# EAGLE board Detector (EAGLE 6.4)
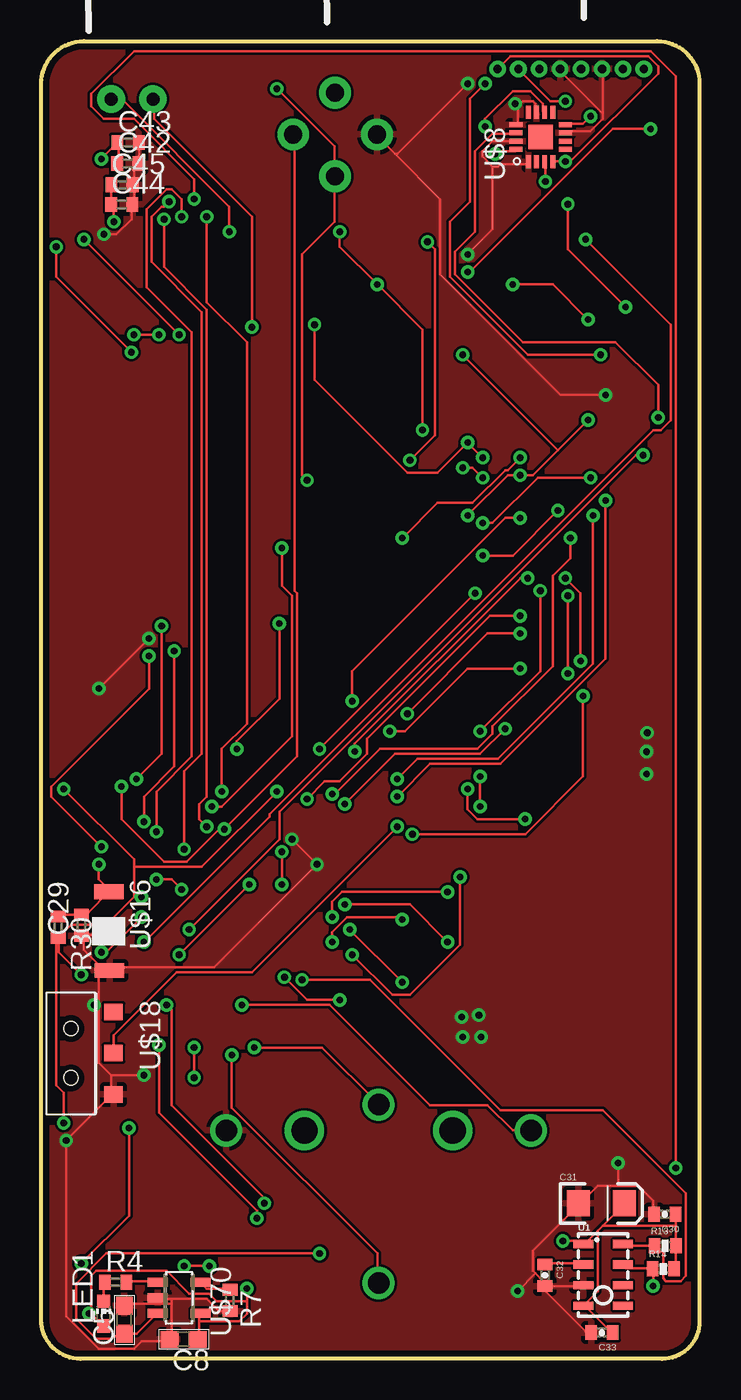
[diagram p7: board, top side]
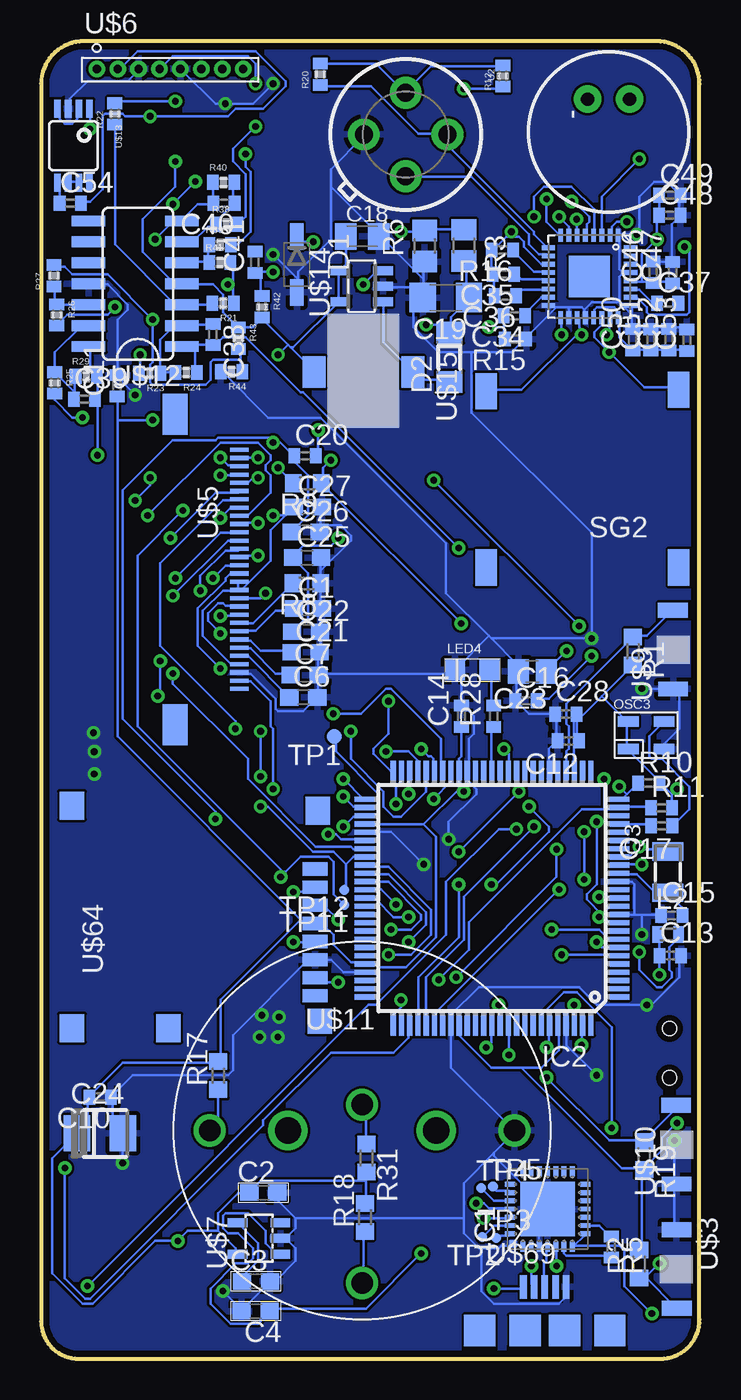
[diagram p8: board, bottom side, seen from below]

Size 40 x 80 mm. Coordinates in mm from the lower left corner, seen from the top.
Outline: 40,77.43 40,2.27 arc-90 37.73,0 2.38,0 arc-90 0,2.38 0,77.4 arc-90 2.6,80 37.43,80 arc-90 40,77.43
Copper layers (1*16): Top 0.035mm / dielectric 1.5mm / Bottom 0.035mm
Design rules "default *": minimum track width 6mil, minimum drill 16mil, track to track 6mil, track to pad 6mil, pad to pad 6mil, via to via 6mil, smd to smd 6mil, copper to edge 15mil, drill to drill 8mil, minimum pad ring 10mil, minimum via ring 8mil, stop-mask expansion 4mil, vias tented up to drill 0mil, thermal gap 10mil
Net classes: 3 battery: width 0.229 mm

## Footprints (pad centres in the part's own frame; a part is rotated, then mirrored left to right if it is on the bottom)
C0603 = smd 1.1 x 1: 1 -0.85,0; 2 0.85,0
C0402 = smd 0.7 x 0.9: 1 -0.65,0; 2 0.65,0
0402 = smd 0.7 x 0.9: 1 -0.65,0; 2 0.65,0
C0805K = smd 1.3 x 1.6: 1 -1,0; 2 1,0
C1206 = smd 1.6 x 1.8: 1 -1.4,0; 2 1.4,0
0805 = smd 1.3 x 1.5: 1 -0.85,0; 2 0.85,0
C106B = smd 1.6 x 2.2: 1 -1.4,0; 2 1.4,0
0402-CAP = smd 0.7 x 0.9: 1 -0.65,0; 2 0.65,0
EIA3216 = smd 1.4 x 1.6: A 1.4,0; C -1.4,0
SOD123 = smd 1.6 x 0.8: 1 -1.7,0; 2 1.7,0
SOD-123 = smd 1.3 x 1.6: 1 -1.5,0; 2 1.5,0
MLP28 = smd 0.6 x 0.3: 1 -2.3,1.5; 2 -2.3,1; 3 -2.3,0.5; 4 -2.3,0; 5 -2.3,-0.5; 6 -2.3,-1; 7 -2.3,-1.5; 15 2.3,-1.5; 16 2.3,-1; 17 2.3,-0.5; 18 2.3,0; 19 2.3,0.5; 20 2.3,1; 21 2.3,1.5 | smd 0.3 x 0.6: 8 -1.5,-2.3; 9 -1,-2.3; 10 -0.5,-2.3; 11 0,-2.3; 12 0.5,-2.3; 13 1,-2.3; 14 1.5,-2.3; 22 1.5,2.3; 23 1,2.3; 24 0.5,2.3; 25 0,2.3; 26 -0.5,2.3; 27 -1,2.3; 28 -1.5,2.3 | smd 3.3 x 3.3: EXP 0,0 | smd 0.435 x 0.435: M -2.103,2.103
LQFP100 = smd 1.2 x 0.32: 1 -7.75,6; 2 -7.75,5.5; 3 -7.75,5; 4 -7.75,4.5; 5 -7.75,4; 6 -7.75,3.5; 7 -7.75,3; 8 -7.75,2.5; 9 -7.75,2; 10 -7.75,1.5; 11 -7.75,1; 12 -7.75,0.5; 13 -7.75,0; 14 -7.75,-0.5; 15 -7.75,-1; 16 -7.75,-1.5; 17 -7.75,-2; 18 -7.75,-2.5; 19 -7.75,-3; 20 -7.75,-3.5; 21 -7.75,-4; 22 -7.75,-4.5; 23 -7.75,-5; 24 -7.75,-5.5; 25 -7.75,-6; 51 7.75,-6; 52 7.75,-5.5; 53 7.75,-5; 54 7.75,-4.5; 55 7.75,-4; 56 7.75,-3.5; 57 7.75,-3; 58 7.75,-2.5; 59 7.75,-2; 60 7.75,-1.5; 61 7.75,-1; 62 7.75,-0.5; 63 7.75,0; 64 7.75,0.5; 65 7.75,1; 66 7.75,1.5; 67 7.75,2; 68 7.75,2.5; 69 7.75,3; 70 7.75,3.5; 71 7.75,4; 72 7.75,4.5; 73 7.75,5; 74 7.75,5.5; 75 7.75,6 | smd 0.32 x 1.2: 26 -6,-7.75; 27 -5.5,-7.75; 28 -5,-7.75; 29 -4.5,-7.75; 30 -4,-7.75; 31 -3.5,-7.75; 32 -3,-7.75; 33 -2.5,-7.75; 34 -2,-7.75; 35 -1.5,-7.75; 36 -1,-7.75; 37 -0.5,-7.75; 38 0,-7.75; 39 0.5,-7.75; 40 1,-7.75; 41 1.5,-7.75; 42 2,-7.75; 43 2.5,-7.75; 44 3,-7.75; 45 3.5,-7.75; 46 4,-7.75; 47 4.5,-7.75; 48 5,-7.75; 49 5.5,-7.75; 50 6,-7.75; 76 6,7.75; 77 5.5,7.75; 78 5,7.75; 79 4.5,7.75; 80 4,7.75; 81 3.5,7.75; 82 3,7.75; 83 2.5,7.75; 84 2,7.75; 85 1.5,7.75; 86 1,7.75; 87 0.5,7.75; 88 0,7.75; 89 -0.5,7.75; 90 -1,7.75; 91 -1.5,7.75; 92 -2,7.75; 93 -2.5,7.75; 94 -3,7.75; 95 -3.5,7.75; 96 -4,7.75; 97 -4.5,7.75; 98 -5,7.75; 99 -5.5,7.75; 100 -6,7.75
L0603 = smd 0.635 x 1.016: P$1 -0.635,0; P$2 0.635,0
CHIP-LED0603 = smd 0.8 x 0.8: A 0,-0.75; C 0,0.75
LED_0805 = smd 1.2 x 1.25: A 1.05,0; K -1.05,0
MIC-9.7MM = drill 0.8 pad 1.676: 1 -2,1.27; 2 -2,-1.27
OSC3.2X.2.5 = smd 1.27 x 0.635: P$1 -1.092,-0.838; P$2 1.092,-0.838; P$3 1.092,0.838; P$4 -1.092,0.838
FC135 = smd 1.1 x 1.9: X1 -1.25,0; X2 1.25,0
R0603 = smd 1 x 1.1: 1 -0.85,0; 2 0.85,0
R0805 = smd 1.3 x 1.5: 1 -0.95,0; 2 0.95,0
R0402 = smd 0.7 x 0.9: 1 -0.65,0; 2 0.65,0
0402-RES = smd 0.7 x 0.9: 1 -0.65,0; 2 0.65,0
SMS-1308 = smd 1.3 x 2.2: + -5.85,1.1; - 5.85,1.2; P$3 -5.85,11.9; P$4 5.85,11.9
TP09R = smd 0.9 x 0.9: TP 0,0
TP06R = smd 0.6 x 0.6: TP 0,0
LGA8 = smd 1.2 x 0.5: 1 -1.2,1.875; 2 -1.2,0.625; 3 -1.2,-0.625; 4 -1.2,-1.875; 5 1.2,-1.875; 6 1.2,-0.625; 7 1.2,0.625; 8 1.2,1.875
TO-39 = drill 1.1 pad 1.93: 1 2.54,0; 2 0,2.54; 3 -2.54,0; 4 0,-2.54
QFN-32 = smd 0.285 x 0.8: P$1 -1.75,-2.5; P$2 -1.25,-2.5; P$3 -0.75,-2.5; P$4 -0.25,-2.5; P$5 0.25,-2.5; P$6 0.75,-2.5; P$7 1.25,-2.5; P$8 1.75,-2.5; P$17 1.75,2.5; P$18 1.25,2.5; P$19 0.75,2.5; P$20 0.25,2.5; P$21 -0.25,2.5; P$22 -0.75,2.5; P$23 -1.25,2.5; P$24 -1.75,2.5 | smd 0.8 x 0.285: P$9 2.5,-1.75; P$10 2.5,-1.25; P$11 2.5,-0.75; P$12 2.5,-0.25; P$13 2.5,0.25; P$14 2.5,0.75; P$15 2.5,1.25; P$16 2.5,1.75; P$25 -2.5,1.75; P$26 -2.5,1.25; P$27 -2.5,0.75; P$28 -2.5,0.25; P$29 -2.5,-0.25; P$30 -2.5,-0.75; P$31 -2.5,-1.25; P$32 -2.5,-1.75 | smd 2.5 x 2.5: P$33 0,0
2.9X3.9X2.0 = smd 0.9 x 1.8: 1 -2.394,0.008; 2 2.379,0.032
30ZIF = smd 0.25 x 1.1: 1 -7.253,0; 2 -6.758,0; 3 -6.26,0; 4 -5.753,0; 5 -5.254,0; 6 -4.756,0; 7 -4.258,0; 8 -3.751,0; 9 -3.252,0; 10 -2.754,0; 11 -2.256,0; 12 -1.749,0; 13 -1.25,0; 14 -0.752,0; 15 -0.254,0; 16 0.254,0; 17 0.752,0; 18 1.25,0; 19 1.749,0; 20 2.256,0; 21 2.754,0; 22 3.252,0; 23 3.751,0; 24 4.258,0; 25 4.756,0; 26 5.254,0; 27 5.753,0; 28 6.26,0; 29 6.758,0; 30 7.253,0 | smd 2.5 x 1.5: P$31 -9.418,-3.899; P$32 9.436,-3.899
HMC-SIP = drill 0.5: 1 0,0; 2 1.27,0; 3 2.54,0; 4 3.81,0; 5 5.08,0; 6 6.35,0; 7 7.62,0; 8 8.89,0
SOT23-5 = smd 0.55 x 1.2: 1 -0.95,-1.3; 2 0,-1.3; 3 0.95,-1.3; 4 0.95,1.3; 5 -0.95,1.3
LCC-16 = smd 0.8 x 0.3: 1 -1.5,0.75; 2 -1.5,0.25; 3 -1.5,-0.25; 4 -1.5,-0.75; 9 1.5,-0.75; 10 1.5,-0.25; 11 1.5,0.25; 12 1.5,0.75 | smd 0.3 x 0.8: 5 -0.75,-1.5; 6 -0.25,-1.5; 7 0.25,-1.5; 8 0.75,-1.5; 13 0.738,1.5; 14 0.25,1.5; 15 -0.25,1.5; 16 -0.75,1.5 | smd 1.5 x 1.5: PAD 0,0
TSWA-3N-CB11_LFS = drill 1.6: 1 4.5,0; 2 -4.5,0 | drill 1.3: A -9.26,0; B 0,-9.26; COM 9.26,0; NO 0,1.57
SO014 = smd 0.66 x 2.032: 1 -3.175,-2.68; 2 -1.905,-2.68; 3 -0.635,-2.68; 4 0.635,-2.68; 5 1.905,-2.68; 6 3.175,-2.68; 7 4.445,-2.68; 8 4.445,2.997; 9 3.175,2.997; 10 1.905,2.997; 11 0.635,2.997; 12 -0.635,2.997; 13 -1.905,2.997; 14 -3.175,2.997
MSOP8 = smd 0.4 x 1.1: 1 -0.975,-2.25; 2 -0.325,-2.25; 3 0.325,-2.25; 4 0.975,-2.25; 5 0.975,2.25; 6 0.325,2.25; 7 -0.325,2.25; 8 -0.975,2.25
SOT23-5L = smd 0.55 x 1.2: 1 -0.95,-1.3; 2 0,-1.3; 3 0.95,-1.3; 4 0.95,1.3; 5 -0.95,1.3
INDUCTORSMD1 = smd 1.9 x 1.4: 1 0,3.001; 2 0,-3.001
AYZ0102 = smd 1 x 1.15: 1 -2.5,2.573; 2 0,2.573; 3 2.5,2.573 | hole 0.85: 1.5,0; -1.5,0
502774-0891 = smd 0.8 x 1.5: 1 2.9,-15.61; 2 1.8,-15.61; 3 0.7,-15.61; 4 -0.4,-15.61; 5 -1.5,-15.61; 6 -2.6,-15.61; 7 -3.7,-15.61; 8 -4.8,-15.61 | smd 1.7 x 1.5: P$1 -6.75,-0.85; P$2 6.75,-0.85; P$3 -6.75,-6.7; P$12 6.45,-15.79 | smd 1.5 x 1.5: P$13 -6.346,-15.898
MICRO_USB = smd 0.4 x 1.4: 1 -1.3,0; 2 -0.65,0; 3 0,0; 4 0.65,0; 5 1.3,0 | smd 1.9 x 1.9: P$6 3.95,-2.65; P$7 -3.95,-2.65; P$8 -1.2,-2.65; P$9 1.2,-2.65

## Placement (x,y rotation side)
C1  1uF  [C0603]  23.77,45.55 0 bottom
C2  2.2uF  [C0603]  26.5,10.09 0 bottom
C3  470pF  [C0603]  26.95,4.7 0 bottom
C4  2.2uF  [C0603]  26.96,2.9 180 bottom
C5  4.7uF  [C0603]  5.06,2.37 90 top
C6  1uF  [C0603]  24.07,40.15 0 bottom
C7  1uF  [C0603]  24,41.52 0 bottom
C8  4.7uF  [C0603]  8.66,1.18 180 top
C10  .1uF  [C0402]  36.41,15.89 180 bottom
C11  100nF  [0402]  35.39,59.07 90 bottom
C12  100nF  [0402]  7.98,37.52 180 bottom
C13  100nF  [0402]  1.77,24.48 0 bottom
C14  100nF  [0402]  14.46,39.02 90 bottom
C15  18pF  [0402]  1.68,26.91 0 bottom
C16  18pF  [0402]  10.54,39.95 0 bottom
C17  100pF  [0402]  2.3,32.36 180 bottom
C18  4.7uF  [C0805K]  20.48,68.15 0 bottom
C19  1uF  [C1206]  15.41,64.43 180 bottom
C20  100pF  [C0402]  23.96,54.83 0 bottom
C21  1uF  [C0603]  23.93,42.9 0 bottom
C22  10uF  [C0603]  23.9,44.14 0 bottom
C23  1uF  [0805]  10.15,41.74 180 bottom
C24  10uF  [C106B]  36.44,13.69 0 bottom
C25  10uF  [C0603]  23.85,48.64 0 bottom
C26  10uF  [C0603]  23.93,50.19 0 bottom
C27  100uF  [C0603]  23.79,51.72 0 bottom
C28  100nF  [0402]  8.12,39.14 0 bottom
C29  100nF  [0402]  2.45,26.34 90 top
C30  0.1uF  [0402-CAP]  37.89,8.78 180 top
C31  10uF  [EIA3216]  34.03,9.44 0 top
C32  0.1uF  [0402-CAP]  30.61,5.07 270 top
C33  1uF  [0402-CAP]  34.07,1.6 180 top
C34  [C0402]  11.25,63.33 180 bottom
C35  [C0402]  11.91,65.85 180 bottom
C36  [C0402]  11.78,64.53 180 bottom
C37  [C0402]  1.94,64.09 0 bottom
C38  [C0402]  29.56,62.19 270 bottom
C39  [C0402]  37.37,58.26 0 bottom
C40  [C0402]  28.9,70.16 180 bottom
C41  [C0402]  27.01,66.58 90 bottom
C42  [C0402]  5.27,72.57 0 top
C43  [C0402]  5.28,73.85 0 top
C44  [C0402]  4.91,70.09 0 top
C45  [C0402]  4.91,71.27 0 top
C46  [C0402]  2.82,65.96 90 bottom
C47  [C0402]  1.64,65.95 90 bottom
C48  [C0402]  1.81,69.43 0 bottom
C49  [C0402]  1.8,70.65 0 bottom
C50  [C0402]  4.06,61.88 90 bottom
C51  [C0402]  2.96,61.86 90 bottom
C52  [C0402]  1.86,61.87 90 bottom
C53  [C0402]  0.78,61.85 90 bottom
C54  [C0402]  38.22,70.16 0 bottom
D1  [SOD123]  24.47,66.45 270 bottom
D2  DIODES  [SOD-123]  15.19,60.81 90 bottom
IC1  CP210X_USB_UART1  [MLP28]  9.23,9.09 90 bottom
IC2  LPC1768  [LQFP100]  12.61,27.98 180 bottom
L2  10uH  [L0603]  1.91,25.76 0 bottom
LED1  [CHIP-LED0603]  3.8,2.74 0 top
LED4  BLUE  [LED_0805]  13.81,41.82 0 bottom
M2  MIC9.7MM  [MIC-9.7MM]  5.53,74.48 270 bottom
OSC3  ASE-12-D-C-T  [OSC3.2X.2.5]  3.25,37.86 0 bottom
Q3  32.768kHz  [FC135]  1.92,29.55 270 bottom
R1  10k  [R0603]  4.04,42.96 270 bottom
R2  10k  [R0603]  3.67,5.76 90 bottom
R3  1M  [R0805]  14.31,67.6 270 bottom
R4  470  [R0402]  4.53,4.65 0 top
R5  4.7k  [R0402]  5.37,6.79 270 bottom
R6  100k  [R0805]  16.7,67.56 90 bottom
R7  33.2k  [R0402]  11.47,3.54 270 top
R8  1M  [R0603]  23.87,47.08 180 bottom
R9  50  [R0603]  23.83,53.16 180 bottom
R10  [R0402]  3.08,34.95 0 bottom
R11  [R0402]  2.31,33.46 0 bottom
R12  10k  [0402-RES]  11.95,77.89 90 bottom
R13  1k  [0402-RES]  37.91,6.86 0 top
R14  1k  [0402-RES]  37.79,5.46 0 top
R15  [R0402]  11.17,61.91 180 bottom
R16  [R0402]  11.99,67.32 180 bottom
R17  10k  [R0603]  29.24,17.19 90 bottom
R18  10k  [R0603]  20.33,8.59 90 bottom
R19  10k  [R0603]  3.36,12.36 270 bottom
R20  10k  [0402-RES]  23.05,77.99 90 bottom
R21  10k  [0402-RES]  28.94,64.09 180 bottom
R22  10k  [0402-RES]  35.53,75.58 90 bottom
R23  10k  [0402-RES]  33.4,59.84 180 bottom
R24  10k  [0402-RES]  31.18,59.88 180 bottom
R25  10k  [0402-RES]  39.17,59.25 270 bottom
R26  10k  [0402-RES]  39.05,63.37 270 bottom
R27  10k  [0402-RES]  39.22,65.76 90 bottom
R28  220R  [0402]  12.51,39.02 90 bottom
R29  10k  [0402-RES]  37.25,59.66 0 bottom
R30  100k  [0402]  1.04,26.2 270 top
R31  10k  [R0603]  20.23,12.19 270 bottom
R38  10k  [0402-RES]  28.74,68.88 0 bottom
R39  10k  [0402-RES]  29.13,67.64 0 bottom
R40  10k  [0402-RES]  28.91,71.43 0 bottom
R41  10k  [0402-RES]  29.14,66.56 0 bottom
R42  200  [0402-RES]  26.58,63.86 270 bottom
R43  10k  [0402-RES]  28.02,61.97 270 bottom
R44  10k  [0402-RES]  28.43,59.93 180 bottom
SG2  BUZZER  [SMS-1308]  7.12,59.94 180 bottom
TP1  TPTP09R  [TP09R]  22.2,37.79 180 bottom
TP2  TPTP06R  [TP06R]  12.36,7.33 180 bottom
TP3  TPTP06R  [TP06R]  13.21,7.38 0 bottom
TP4  TPTP06R  [TP06R]  13.28,10.39 0 bottom
TP5  TPTP06R  [TP06R]  12.55,10.46 0 bottom
TP11  TPTP06R  [TP06R]  21.57,27.56 180 bottom
TP12  TPTP06R  [TP06R]  21.58,28.47 180 bottom
U1  MPL3115A2LGA8  [LGA8]  34.14,5.1 0 top
U2  MLX90614_  [TO-39]  17.86,74.33 270 bottom
U$1  TLV320AI3120  [QFN-32]  6.69,65.71 180 bottom
U$3  RGHT-ANGLE-SMT-SWITCH-688-SKRELF  [2.9X3.9X2.0]  1.41,5.44 270 bottom
U$5  OLED_LCD_1X1  [30ZIF]  27.96,47.93 270 bottom
U$6  HMC1051Z  [HMC-SIP]  36.62,78.31 0 bottom
U$7  V_REG_LDOSMD  [SOT23-5]  26.76,7.31 90 bottom
U$8  HMC1052L  [LCC-16]  30.34,74.18 90 top
U$9  RGHT-ANGLE-SMT-SWITCH-688-SKRELF  [2.9X3.9X2.0]  1.59,43.07 90 bottom
U$10  RGHT-ANGLE-SMT-SWITCH-688-SKRELF  [2.9X3.9X2.0]  1.39,13.01 90 bottom
U$11  TSWA-3N-CDB11_LFS  [TSWA-3N-CB11_LFS]  20.5,13.86 0 bottom
U$12  LMV324  [SO014]  34.12,64.64 90 bottom
U$13  IRF7507  [MSOP8]  38.03,73.65 180 bottom
U$14  ZXLD1615  [SOT23-5L]  20.53,65.12 90 bottom
U$15  INDUCTORSMD  [INDUCTORSMD1]  20.42,59.91 90 bottom
U$16  RGHT-ANGLE-SMT-SWITCH-688-SKRELF  [2.9X3.9X2.0]  4.12,25.96 270 top
U$18  AYZ0102  [AYZ0102]  1.82,18.56 270 top
U$64  USD-CARD  [502774-0891]  38.97,26.84 90 bottom
U$69  MICRO_USB  [MICRO_USB]  9.4,4.36 0 bottom
U$70  MCP73831T-2ACI/OT  [SOT23-5L]  8.38,3.7 270 top

## Tracks (layer width: path | path; a pad name or v marks a point on that pad's centre or on a via)
3.3V
  Bottom 0.152: R12.2 12.04,78.49 16.31,78.49 17.83,76.96 U2.3 17.98,76.96 19.66,78.64 23.01,78.64 R20.2
12MHZ
  Bottom 0.152: C17.1 1.52,32.46 0.61,33.38 0.61,34.75 2.29,36.42 2.9,36.42 3.05,36.58 3.05,37.8 2.29,38.56 OSC3.P$3
+1.8V  (via drill 0.41)
  Top 0.152: v3.66,72.85 4.57,73.76 C43.1 4.72,73.76 4.72,72.69 C42.1
  Bottom 0.152: v3.66,72.85 5.94,70.56 5.94,68.28 U$1.P$3
+3.3V  (via drill 0.41)
  Top 0.152: v2.59,67.97 v8.38,62.18
  Bottom 0.152: 3.5,65.38 2.9,65.38 C46.1 2.74,65.38 1.68,65.38 C47.1 | 3.5,65.38 4.12,65.38 U$1.P$28 | v8.38,62.18 8.38,63.09 U$1.P$17 | C49.1 2.44,70.56 2.44,69.49 C48.1 2.59,69.34 v2.59,67.97 3.5,67.06 3.5,65.38
/SS  (via drill 0.41)
  Top 0.152: v17.68,26.82 17.68,27.74 18.29,28.35 v24.69,28.35
  Bottom 0.152: v17.68,26.82 18.59,26.82 19.66,27.89 20.27,27.89 IC2.63 | v24.69,28.35 23.62,28.35 23.47,28.5 U$64.2
BUTTON1
  Bottom 0.152: U$9.2 1.68,45.41 3.2,43.89 3.96,43.89 R1.1 4.12,43.74 8.08,39.78 8.08,38.56 7.92,38.41 7.92,37.03 8.08,36.88 8.08,35.81 IC2.29
BUTTON2  (via drill 0.41)
  Top 0.152: v9.3,17.07 v9.3,18.9
  Bottom 0.152: U$10.2 1.37,15.24 3.35,13.26 R19.1 3.5,13.26 5.49,13.26 v9.3,17.07 | v9.3,18.9 9.14,19.05 9.14,20.12 IC2.95
BUTTON3  (via drill 0.41)
  Top 0.152: v5.33,14.02 5.33,8.69 v2.44,5.79
  Bottom 0.152: 3.35,4.88 3.2,4.88 1.52,3.2 U$3.2 | 3.35,4.88 3.66,4.88 R2.1 3.35,4.88 | v5.33,14.02 5.33,20.12 7.47,22.25 8.23,22.25 9.6,20.88 9.6,20.27 IC2.94 | 3.35,4.88 v2.44,5.79
CHG_STAT
  Top 0.152: R4.2 5.33,4.72 7.01,4.72 U$70.1
CS  (via drill 0.41)
  Top 0.152: v16.92,37.03 v26.36,46.48
  Bottom 0.152: v26.36,46.48 26.67,46.18 27.89,46.18 U$5.19 | v16.92,37.03 16.46,36.58 16.31,36.58 16.15,36.42 16.15,35.81 IC2.45
D0  (via drill 0.41)
  Top 0.152: v25.45,29.26 25.45,25.15 22.4,22.1 21.34,22.1 v18.9,24.54 | v26.82,48.77 28.65,48.77 v31.39,51.51
  Bottom 0.152: v25.45,29.26 25.15,29.57 | 25.15,29.57 24.23,30.48 22.55,30.48 22.25,30.18 22.25,28.19 21.64,27.58 TP11.TP | v18.9,24.54 17.53,24.54 16.31,25.76 16.31,27.28 18.9,29.87 20.27,29.87 IC2.59 | v26.82,48.77 27.89,48.77 U$5.14 | v31.39,51.51 34.14,48.77 34.14,38.41 25.3,29.57 25.15,29.57
D1  (via drill 0.41)
  Top 0.152: v30.33,46.63 30.33,41.76 v26.67,38.1 | v26.67,33.53 v26.67,35.36
  Bottom 0.152: 21.49,30.02 21.49,28.5 TP12.TP | 21.49,30.02 21.03,30.48 20.42,30.48 IC2.58 | v30.33,46.63 30.33,47.55 28.8,49.07 28.04,49.07 U$5.13 | v26.67,35.36 v26.67,38.1 | v26.67,33.53 26.21,33.53 23.47,30.79 22.25,30.79 21.49,30.02
D2  (via drill 0.41)
  Top 0.152: v32,41.6 v32,46.33
  Bottom 0.152: v32,46.33 28.65,49.68 28.04,49.68 U$5.12 | v32,41.6 32,41 27.43,36.42 27.43,35.2 23.32,31.09 21.18,31.09 21.03,30.94 20.42,30.94 IC2.57
D3  (via drill 0.41)
  Top 0.152: v31.85,47.4 32.77,46.48 v32.77,42.37 | v32.92,40.23 32.92,35.36 29.41,31.85 v22.55,31.85
  Bottom 0.152: v31.85,47.4 29.11,50.14 28.04,50.14 U$5.11 | v32.77,42.37 32.77,40.39 v32.92,40.23 | v22.55,31.85 22.1,31.85 21.79,31.55 20.42,31.55 IC2.56
D4  (via drill 0.41)
  Top 0.152: v26.82,50.75 27.43,50.75 30.18,53.49 v33.38,53.49 | v34.29,52.12 34.29,42.52 27.89,36.12 23.62,36.12 v21.64,34.14
  Bottom 0.152: v26.82,50.75 27.89,50.75 U$5.10 | v33.38,53.49 33.38,53.03 v34.29,52.12 | v21.64,34.14 21.03,33.53 20.42,33.53 IC2.52
D5  (via drill 0.41)
  Top 0.152: v33.53,51.21 33.53,42.22 27.74,36.42 22.86,36.42 v21.64,35.2
  Bottom 0.152: v33.53,51.21 29.11,55.63 26.82,55.63 26.06,54.86 26.06,54.56 26.36,54.25 26.36,53.95 26.06,53.65 26.06,52.58 27.43,51.21 27.89,51.21 U$5.9 | v21.64,35.2 20.42,33.98 IC2.51
D6  (via drill 0.41)
  Top 0.152: v29.11,51.05 28.19,51.05 18.9,41.76 v18.9,39.93
  Bottom 0.152: v29.11,51.05 28.5,51.66 28.04,51.66 U$5.8 | v18.9,39.93 18.9,37.95 19.81,37.03 19.81,36.73 18.75,35.66 IC2.50
D7  (via drill 0.41)
  Top 0.152: v28.19,38.25 26.67,36.73 21.49,36.73 v18.44,33.68
  Bottom 0.152: v28.19,38.25 28.19,38.71 32.77,43.28 32.77,48.31 28.96,52.12 28.04,52.12 U$5.7 | v18.44,33.68 18.44,34.75 18.14,35.05 18.14,35.66 IC2.49
D8  (via drill 0.41)
  Top 0.152: v32.16,49.84 32.16,48.62 31.09,47.55 31.09,42.06 27.43,38.41 27.43,37.95 26.52,37.03 20.57,37.03 17.83,34.29 v17.68,34.29
  Bottom 0.152: v32.16,49.84 29.41,52.58 28.04,52.58 U$5.6 | v17.68,34.29 17.68,35.66 IC2.48
D/C  (via drill 0.41)
  Top 0.152: v29.11,44.04 27.13,44.04 v22.25,39.17
  Bottom 0.152: v29.11,44.04 29.87,44.81 29.87,45.26 29.26,45.87 28.96,45.87 28.8,45.72 28.04,45.72 U$5.20 | v22.25,39.17 20.57,39.17 19.05,40.69 18.75,40.69 15.7,37.64 15.7,35.81 IC2.44
DMINUS  (via drill 0.41)
  Top 0.152: v10.21,5.64 v8.69,5.64
  Bottom 0.152: v8.69,5.64 8.69,6.71 IC1.5 | v10.21,5.64 10.21,4.57 10.06,4.42 U$69.2
DPLUS
  Bottom 0.152: IC1.4 9.3,6.71 9.3,5.94 9.45,5.79 9.45,4.42 U$69.3
ERD  (via drill 0.41)
  Top 0.152: v29.57,47.4 29.11,47.4 19.05,37.34 v19.05,36.88
  Bottom 0.152: v29.57,47.4 28.8,48.16 28.04,48.16 U$5.15 | v19.05,36.88 17.68,36.88 17.07,36.27 17.07,35.81 IC2.47
GND  (via drill 0.41)
  Top 0.152: 7.92,3.66 7.16,3.66 U$70.2 | 7.92,3.66 10.06,3.66 10.82,2.9 11.43,2.9 R7.2 | 7.92,3.66 7.92,3.35 | 7.92,3.35 7.92,1.22 C8.2 7.77,1.07 6.1,1.07 5.64,0.61 3.5,0.61 1.52,2.59 v1.52,13.26 4.27,16 U$18.3 4.27,16.15 4.27,17.22 | 7.92,3.35 5.18,3.35 C5.2 | 3.5,23.93 3.81,23.62 4.12,23.62 U$16.2 | 3.5,23.93 2.59,24.84 2.59,25.6 C29.1 2.59,25.76 v3.5,25.76 | 4.27,17.22 3.5,17.98 3.5,21.49 | 3.5,23.93 3.5,21.49 | 3.5,23.93 U$16.2 | 4.27,17.22 v6.25,17.22 | U$16.2 3.81,23.77 10.52,23.77 v16.76,30.02 v15.24,31.55 | C32.2 30.63,4.42 32.92,4.42 U1.3 | C33.2 33.38,1.68 33.07,1.68 30.48,4.27 C32.2 | 35.05,10.52 33.83,10.52 32.77,9.45 C31.C 32.61,9.3 29.87,6.55 29.87,5.33 30.02,5.18 | 35.05,10.52 36.27,10.52 37.19,9.6 37.19,8.84 C30.2 | 30.02,5.18 30.48,4.72 30.48,4.42 C32.2 | v35.05,11.89 35.05,10.52 | v28.96,4.12 30.02,5.18 | v3.2,21.49 3.5,21.49 | v6.55,43.74 v3.5,40.69 | C43.2 5.94,73.76 5.94,72.69 C42.2 5.79,72.54 5.64,72.39 5.64,71.32 C45.2 5.64,71.17 5.64,70.1 C44.2 5.49,69.95 5.49,69.19 4.57,68.28 v3.81,68.28 | 28.96,76.05 28.96,74.98 U$8.13 | 28.96,76.05 29.26,76.35 29.87,76.35 30.02,76.2 30.02,75.74 U$8.11 | v28.8,76.2 28.96,76.05 | 34.14,75.59 34.14,78.18 U$6.3 | 34.14,75.59 34.14,75.29 33.38,74.52 31.85,74.52 U$8.7 | 34.14,75.59 31.55,78.18 U$6.5 | 27.43,72.39 27.74,72.39 27.89,72.54 29.57,72.54 U$8.1 | 27.43,72.39 26.82,73 26.82,73.3 27.43,73.91 28.8,73.91 U$8.15 | 27.43,72.39 27.43,68.58 v25.91,67.06 | v34.29,58.52 31.55,58.52 24.23,65.84 24.23,70.41 21.49,73.15 | 21.49,73.15 20.42,74.22 U2.4 | v25.91,77.42 21.64,73.15 21.49,73.15
  Bottom 0.152: U$3.1 1.52,7.92 1.52,10.52 U$10.1 1.52,10.67 v1.52,13.26 | 3.96,26.98 4.72,26.98 IC2.11 | 3.96,26.98 3.5,26.98 | 3.5,26.98 2.44,26.98 C15.1 | 3.96,26.98 3.96,28.8 4.12,28.96 4.72,28.96 IC2.15 | v6.25,17.22 8.08,19.05 8.08,20.12 IC2.97 | v16.76,30.02 18.75,32 20.27,32 IC2.55 | v3.5,25.76 3.5,26.98 | IC2.72 20.42,23.47 21.64,23.47 22.4,24.23 23.32,24.23 U$64.6 23.47,24.23 23.77,24.23 28.35,19.66 28.35,17.53 28.65,17.22 34.44,17.22 35.66,16 C10.1 35.66,15.85 35.66,14.33 35.05,13.72 C24.2 35.05,13.56 v35.05,11.89 | C13.2 1.22,24.38 1.22,23.16 2.9,21.49 v3.2,21.49 6.25,21.49 7.32,22.55 13.41,22.55 15.09,20.88 15.09,20.27 IC2.83 15.09,20.12 15.09,17.68 11.28,13.87 U$11.COM 11.28,13.72 12.5,12.5 | 24.54,8.53 25.6,9.6 25.6,10.06 C2.2 | 24.54,8.53 24.54,7.92 25.15,7.32 | 25.15,7.32 U$7.2 25.15,7.32 | 25.15,7.32 24.54,6.71 24.54,5.94 25.76,4.72 26.06,4.72 C3.2 26.21,4.57 27.74,3.05 C4.2 27.89,3.05 v28.96,4.12 | IC1.3 9.75,6.86 9.75,8.53 9.3,8.99 IC1.EXP 9.3,9.14 12.5,12.34 12.5,12.5 | 11.28,7.01 IC1.M 11.43,6.86 12.04,6.86 12.19,6.71 13.26,6.71 | 13.26,6.71 13.41,6.71 14.33,7.62 14.33,8.53 | 14.33,8.53 14.33,10.67 12.5,12.5 | 13.26,6.71 13.26,4.12 12.5,3.35 8.53,3.35 8.23,3.66 8.23,4.27 U$69.5 | 14.33,8.53 24.54,8.53 | 23.01,50.6 23.01,50.29 C26.2 23.01,50.6 | 23.01,50.6 23.01,51.66 C27.2 | C7.2 23.16,41.6 23.16,42.82 C21.2 23.01,42.98 23.01,44.04 C22.2 23.01,44.2 23.01,45.41 C1.2 23.01,45.57 23.01,46.94 R8.1 23.01,47.09 23.01,47.85 | C7.2 23.16,41.45 23.16,40.23 C6.2 23.32,40.08 24.08,39.32 25.6,39.32 25.76,39.47 25.76,40.08 27.28,41.6 27.89,41.6 U$5.28
  Bottom 0.152: 23.01,47.85 23.01,48.62 C25.2 | 23.01,50.6 21.79,50.6 21.18,49.99 21.18,49.68 23.01,47.85 | 14.63,41.6 14.78,41.76 LED4.K | 14.63,41.6 14.48,41.45 14.48,39.78 C14.2 14.33,39.62 13.72,39.01 13.72,37.95 14.02,37.64 14.02,35.81 IC2.41 14.02,35.66 14.02,35.05 13.56,34.59 13.56,34.29 15.24,32.61 v15.24,31.55 | OSC3.P$2 2.13,37.03 2.13,37.34 1.22,38.25 1.22,40.23 1.52,40.54 U$9.1 1.68,40.69 v3.5,40.69 | IC2.31 9.14,35.81 9.14,37.03 8.69,37.49 C12.2 8.69,37.64 8.69,39.01 C28.1 8.84,39.17 10.36,39.17 11.12,39.93 C16.1 11.12,40.08 11.12,41.6 C23.2 11.12,41.76 11.12,42.22 12.65,43.74 | 12.65,43.74 12.8,43.89 | 12.8,43.89 15.39,46.48 15.39,49.53 23.01,57.15 26.21,57.15 28.96,59.89 R44.2 | 12.65,43.74 v6.55,43.74 6.55,50.14 13.87,57.45 13.87,61.11 | 12.8,43.89 14.78,41.91 LED4.K | 14.63,41.6 23.01,41.6 C7.2 | 14.63,41.6 LED4.K | 1.68,66.6 2.74,66.6 C46.2 | 1.68,66.6 1.68,68.89 1.22,69.34 C48.2 1.22,69.49 1.22,70.56 C49.2 1.22,70.71 1.98,71.48 2.74,71.48 3.66,70.56 3.66,68.43 v3.81,68.28 4.88,68.28 U$1.P$1 4.88,68.12 4.88,66.14 4.72,65.99 | 1.68,66.6 C47.2 | 7.01,63.7 7.01,63.25 U$1.P$20 | 7.01,63.7 7.16,63.86 7.92,63.86 | 8.69,63.86 9.14,63.86 U$1.P$16 | 8.69,63.86 7.92,63.86 | 7.92,63.86 7.92,63.25 U$1.P$18 | 8.69,63.86 10.52,62.03 R15.1 10.67,61.87 11.43,61.11 13.87,61.11 | 4.72,65.99 4.27,65.99 U$1.P$29 | C53.2 0.91,62.64 1.83,62.64 C52.2 1.98,62.64 2.9,62.64 C51.2 3.05,62.64 3.96,62.64 C50.2 4.12,62.64 4.12,63.4 | 4.12,63.4 4.12,63.86 U$1.P$25 | 4.72,65.99 4.72,65.84 4.88,65.68 4.88,64.16 | 4.12,63.4 4.88,64.16 | 7.01,63.7 6.55,64.16 4.88,64.16 | U$6.5 31.39,78.18 29.41,76.2 v28.8,76.2 27.13,76.2 v25.91,77.42
  Bottom 0.152: U$13.3 38.25,76.05 38.25,76.5 37.19,77.57 34.75,77.57 34.14,78.18 U$6.3 | U$12.11 37.03,65.23 35.97,65.23 34.75,64.01 34.75,63.7 35.36,63.09 35.36,59.74 C11.2 35.36,59.59 v34.29,58.52 | 17.37,64.92 16.92,64.47 C19.2 | 17.37,64.92 17.53,65.08 19.2,65.08 U$14.2 | 16.76,65.53 16.76,64.47 C19.2 | 16.76,65.53 16.76,66.6 R6.1 | 16.76,65.53 19.36,68.12 C18.2 19.51,68.28 22.4,71.17 | 24.38,65.53 24.38,65.99 22.4,67.97 22.4,71.17 | 24.38,65.53 24.38,64.77 D1.2 24.38,65.53 | 22.4,71.17 22.4,72.24 20.42,74.22 U2.4 | 24.38,65.53 v25.91,67.06 | 13.87,61.11 15.85,61.11 17.37,62.64 17.37,64.92 | 17.37,64.92 C19.2
  other vias: 25.62,19.54 26.73,19.54 25.55,20.76 26.59,20.86 36.77,35.51 36.77,36.86 36.82,38.01
  pour Bottom: -0.15,81.25 41.42,81.25 41.42,-1.65 -0.07,-1.65 -0.07,80.76
  pour Top: 0.25,80.28 40.87,80.28 40.87,-1.62 0.14,-1.62 0.14,79.68
I2S_RX_CLK  (via drill 0.41)
  Top 0.152: v8.53,69.34 8.53,70.41 7.92,71.02 7.62,71.02 6.4,69.8 6.4,65.08 9.14,62.33 9.14,36.58 7.01,34.44 v7.01,32 | v7.01,29.11 7.92,29.11 v8.53,28.5
  Bottom 0.152: v8.53,69.34 7.92,68.73 7.92,68.28 U$1.P$7 | v7.01,29.11 v7.01,32 | v8.53,28.5 16,21.03 16,20.27 IC2.81
I2S_RX_SDA  (via drill 0.41)
  Top 0.152: v10.06,69.34 10.06,64.16 12.5,61.72 12.5,38.56 10.97,37.03 v10.97,34.44 | v14.63,28.8 v14.63,30.79
  Bottom 0.152: v10.06,69.34 10.06,70.56 9.45,71.17 7.77,71.17 6.4,69.8 6.4,68.28 U$1.P$4 | v14.63,30.79 v10.97,34.44 | v14.63,28.8 14.63,25.6 17.07,23.16 17.07,20.27 IC2.79
I2S_RX_WS  (via drill 0.41)
  Top 0.152: v7.47,69.19 7.47,66.29 10.06,63.7 10.06,34.14 9.6,33.68 9.6,32.77 v10.06,32.31
  Bottom 0.152: v7.47,69.19 7.47,68.28 U$1.P$6 | v10.06,32.31 14.33,28.04 14.33,25.45 16.61,23.16 16.61,20.27 IC2.80
I2S_TX_CLK  (via drill 0.41)
  Top 0.152: v9.3,70.41 9.3,71.63 5.64,75.29 3.81,75.29 3.05,76.05 3.05,76.81 5.64,79.4 37.03,79.4 38.56,77.88 v38.56,11.58
  Bottom 0.152: v9.3,70.41 9.3,69.04 8.53,68.28 U$1.P$8 | v38.56,11.58 38.56,4.88 37.34,3.66 37.03,3.66 26.52,14.17 26.52,14.48 22.4,18.59 18.59,18.59 17.68,19.51 17.68,20.12 IC2.78
I2S_TX_SDA  (via drill 0.41)
  Top 0.152: v7.77,70.26 7.47,69.95 7.32,69.95 6.71,69.34 6.71,66.6 9.75,63.55 9.75,36.73 8.69,35.66 v8.69,30.94 | v14.78,23.16 16.15,21.79 v18.14,21.79
  Bottom 0.152: v7.77,70.26 7.62,70.26 6.71,69.34 6.71,69.04 6.86,68.89 6.86,68.28 U$1.P$5 | v8.69,30.94 8.69,29.26 v14.78,23.16 | v18.14,21.79 18.14,21.34 18.59,20.88 18.59,20.27 IC2.76
IC6_RTC1
  Bottom 0.152: C15.2 1.07,26.98 1.07,27.43 1.83,28.19 Q3.X2 1.98,28.35 2.74,28.35 3.81,29.41 4.72,29.41 IC2.16
IC6_RTC2  (via drill 0.41)
  Top 0.152: v6.55,42.67 6.55,40.69 0.61,34.75 0.61,34.14 v3.66,31.09
  Bottom 0.152: v6.55,42.67 9.14,40.08 9.75,40.08 C16.2 | 3.81,30.94 4.27,30.48 4.72,30.48 IC2.18 | 3.81,30.94 1.98,30.94 Q3.X1 | 3.81,30.94 v3.66,31.09
IC6_XTAL1
  Bottom 0.152: C17.2 3.05,32.46 4.72,32.46 IC2.22
IOVDD  (via drill 0.41)
  Top 0.152: v4.42,69.04 4.42,69.8 4.27,69.95 C44.1 4.27,70.1 4.27,71.17 C45.1
  Bottom 0.152: v4.42,69.04 5.03,69.04 5.33,68.73 5.33,68.28 U$1.P$2
IREF
  Bottom 0.152: U$5.22 27.89,44.65 27.13,44.65 24.84,46.94 R8.2
LED-3
  Bottom 0.152: R28.1 12.65,38.25 12.65,35.81 IC2.38
MAG_INV_OUT  (via drill 0.41)
  Top 0.152: v33.38,75.44 32.92,74.98 31.85,74.98 U$8.8
  Bottom 0.152: C54.2 37.49,70.26 37.03,70.26 36.27,71.02 36.27,75.44 36.12,75.59 35.05,75.59 34.9,75.44 v33.38,75.44 28.65,75.44 28.19,75.89 26.52,75.89 25.15,77.27 25.15,77.57 26.98,79.4 34.14,79.4 35.2,78.33 U$6.2
MAG_INVERTER_INPUT
  Bottom 0.152: U$13.2 37.8,75.89 37.8,75.29 38.1,74.98 38.56,74.98 38.86,75.29 38.86,75.89 U$13.4
MAG_INVERTER_OUTPUT
  Bottom 0.152: U$13.8 37.19,71.48 37.64,71.48 U$13.7 37.8,71.48 38.25,71.48 U$13.6 38.41,71.48 38.86,71.48 U$13.5 38.86,71.32 38.86,70.26 C54.1
MAG_X_IN+  (via drill 0.41)
  Top 0.152: v30.63,71.48 30.63,72.54 U$8.3 | v32,70.1 32,67.36 v35.51,63.86
  Bottom 0.152: v32,70.1 v30.63,71.48 | v35.51,63.86 35.97,63.4 38.41,63.4 39.01,62.79 R26.2
MAG_X_IN-  (via drill 0.41)
  Top 0.152: v37.49,57.15 37.49,59.13 34.9,61.72 29.26,61.72 25.15,65.84 25.15,67.21 26.36,68.43 26.36,73.3 27.43,74.37 28.8,74.37 U$8.14
  Bottom 0.152: v37.49,57.15 38.1,57.15 39.17,58.22 39.17,58.52 R25.2
MAG_X_OUT  (via drill 0.41)
  Top 0.152: v8.99,26.06 14.48,31.55 14.48,33.22 36.12,54.86 v36.58,54.86
  Bottom 0.152: v8.99,26.06 6.1,26.06 5.49,25.45 4.88,25.45 IC2.8 | v36.58,54.86 36.58,58.22 C39.2 36.58,58.37 36.58,59.59 R29.2 36.73,59.74 37.03,60.05 37.03,61.42 U$12.14
MAG_Y_IN+  (via drill 0.41)
  Top 0.152: v27.58,73.15 27.74,73.3 28.8,73.3 U$8.16
  Bottom 0.152: v27.58,73.15 27.58,72.39 27.28,72.08 27.28,68.43 28.04,67.67 28.35,67.67 R39.2
MAG_Y_IN-  (via drill 0.41)
  Top 0.152: v26.98,74.83 26.98,75.29 28.65,76.96 29.72,76.96 30.48,76.2 30.48,75.74 U$8.10
  Bottom 0.152: v26.98,74.83 28.35,73.46 28.35,72.69 27.58,71.93 27.58,69.34 28.04,68.89 R38.2
MAG_Y_OUT  (via drill 0.41)
  Top 0.152: v6.25,25.3 13.87,32.92 13.87,33.07 37.19,56.39 37.64,56.39 38.25,57 38.25,62.79 v33.07,67.97
  Bottom 0.152: R40.1 29.57,71.32 29.57,70.26 C40.2 29.57,70.1 30.48,70.1 31.39,69.19 U$12.7 31.55,69.04 32,69.04 v33.07,67.97 | v6.25,25.3 5.94,24.99 4.88,24.99 IC2.7
MAG_Z_IN+  (via drill 0.41)
  Top 0.152: v31.85,76.35 30.94,76.35 29.11,78.18 U$6.7
  Bottom 0.152: v31.85,76.35 35.51,76.35 R22.2
MAG_Z_IN-  (via drill 0.41)
  Top 0.152: v33.98,60.96 29.57,60.96 24.84,65.68 24.84,69.04 26.06,70.26 26.06,76.5 v26.98,77.42
  Bottom 0.152: v33.98,60.96 33.98,59.89 R23.2 | v26.98,77.42 26.98,78.64 27.43,79.1 32,79.1 32.77,78.33 U$6.4
MAG_Z_OUT  (via drill 0.41)
  Top 0.152: v12.65,28.8 v8.38,24.54 | v10.36,33.53 10.97,33.53 15.24,37.8 15.24,46.33 14.63,46.94 v14.63,49.23
  Bottom 0.152: 30.63,61.57 31.39,61.57 U$12.1 30.63,61.57 | 30.63,61.57 29.57,61.57 C38.2 29.41,61.57 28.96,62.03 27.58,62.03 24.23,58.67 24.08,58.67 v14.63,49.23 | 30.63,61.57 30.63,59.89 R24.1 | v8.38,24.54 4.88,24.54 IC2.6 | v12.65,28.8 12.34,28.8 9.14,32 9.14,32.31 v10.36,33.53
MICM  (via drill 0.41)
  Top 0.152: v12.8,62.64 12.8,69.34 6.86,75.29 6.86,76.35 M2.2
  Bottom 0.152: 11.89,62.64 11.89,63.25 C34.2 | 11.89,62.64 11.89,62.03 R15.2 | v12.8,62.64 11.89,62.64
MICP  (via drill 0.41)
  Top 0.152: v11.43,68.43 11.43,69.95 5.03,76.35 4.27,76.35 M2.1
  Bottom 0.152: C36.2 12.5,64.62 12.5,65.84 C35.2 12.65,65.99 12.65,67.21 R16.2 12.5,67.36 11.73,68.12 11.43,68.12 | 11.43,68.12 10.97,68.12 10.67,67.82 10.67,67.51 9.6,66.45 9.3,66.45 U$1.P$11 | v11.43,68.43 11.43,68.12
MISO  (via drill 0.41)
  Top 0.152: v21.95,22.86 v18.75,26.06
  Bottom 0.152: v18.75,26.06 17.53,26.06 16.92,26.67 16.92,26.98 18.9,28.96 20.27,28.96 IC2.61 | v21.95,22.86 23.16,22.86 23.32,23.01 U$64.7
MOSI  (via drill 0.41)
  Top 0.152: v17.68,25.3 17.68,25.91 18.59,26.82 21.79,26.82 v21.95,26.67
  Bottom 0.152: v17.68,25.3 16.61,26.36 16.61,27.13 18.9,29.41 20.27,29.41 IC2.60 | v21.95,26.67 22.71,27.43 23.32,27.43 U$64.3
N$1
  Bottom 0.152: IC1.9 6.86,8.08 6.1,8.08 5.49,7.47 R5.1
N$2
  Bottom 0.152: C3.1 27.74,4.72 27.74,5.03 26.82,5.94 26.82,7.01 28.04,8.23 U$7.4
N$3  (via drill 0.41)
  Top 0.152: v23.16,56.39 23.16,62.48 v20.42,65.23 18.14,67.51 v18.14,68.43
  Bottom 0.152: R3.1 14.33,68.58 16.61,68.58 R6.2 16.76,68.43 v18.14,68.43 | v23.16,56.39 23.16,54.86 C20.2 | v20.42,65.23 19.66,65.99 19.36,65.99 U$14.3
N$5  (via drill 0.41)
  Top 0.152: v22.4,54.56 23.93,56.08 23.93,67.36 v23.47,67.82 | v11.89,37.03 11.89,37.49 14.48,40.08 v14.48,44.65
  Bottom 0.152: v22.4,54.56 22.86,54.1 22.86,53.19 R9.1 22.86,53.03 v14.48,44.65 | v23.47,67.82 24.08,67.82 24.38,68.12 D1.1 | v11.89,37.03 11.58,36.73 11.58,35.81 IC2.36
N$7
  Bottom 0.152: R24.2 31.85,59.89 32.61,59.89 R23.1 32.77,59.89 32.77,61.87 32,62.64 31.55,62.64 U$12.2 31.39,62.79 29.57,62.79 C38.1
N$8
  Bottom 0.152: IC1.24 11.58,9.6 12.5,9.6 13.26,10.36 TP4.TP
N$9
  Bottom 0.152: U$14.1 19.2,64.16 19.2,61.72 17.53,60.05 U$15.2 17.37,59.89 16.92,59.44 15.24,59.44 D2.1
N$10
  Bottom 0.152: R21.2 29.72,64.01 31.39,64.01 U$12.3 31.55,64.01 31.85,64.01 35.51,67.67 35.51,74.83 R22.1
N$11
  Bottom 0.152: IC1.23 11.58,10.21 12.34,10.21 12.5,10.36 TP5.TP
N$12  (via drill 0.41)
  Top 0.152: v0.91,67.51 0.91,65.68 v5.49,61.11
  Bottom 0.152: U$1.P$22 5.94,63.09 5.94,62.79 6.4,62.33 6.4,62.03 v5.49,61.11 3.35,58.98 1.37,58.98 SG2.+ | v0.91,67.51 0.61,67.21 0.61,63.55 0.76,63.4 3.05,63.4 3.2,63.55 3.2,63.86 3.81,64.47 4.12,64.47 U$1.P$26
N$13
  Bottom 0.152: IC1.27 11.58,8.08 12.5,8.08 13.11,7.47 TP3.TP
N$17  (via drill 0.41)
  Top 0.152: v7.16,62.18 v5.64,62.18
  Bottom 0.152: v5.64,62.18 5.49,62.33 5.49,63.09 U$1.P$23 | U$1.P$19 7.32,63.09 7.32,62.64 7.16,62.48 v7.16,62.18 7.47,62.18 10.82,58.83 12.95,58.83 SG2.-
N$18
  Bottom 0.152: R28.2 12.65,39.78 12.65,41.76 LED4.A
N$19  (via drill 0.41)
  Top 0.152: v3.66,24.69 3.96,24.69 v6.1,26.82 | v8.08,42.98 8.08,35.97 6.25,34.14 v6.25,32.61
  Bottom 0.152: v3.66,24.69 3.66,23.62 2.59,22.55 2.29,22.55 1.68,23.16 1.68,23.47 1.83,23.62 1.83,24.99 1.37,25.45 1.37,25.76 L2.P$2 | 5.94,26.98 5.49,27.43 4.88,27.43 IC2.12 | 5.94,26.98 5.49,26.52 4.88,26.52 IC2.10 | v8.08,42.98 9.3,41.76 C23.1 | v6.25,32.61 6.25,28.8 6.86,28.19 6.86,27.89 5.94,26.98 | 5.94,26.98 v6.1,26.82
N$31
  Top 0.152: C32.1 30.63,5.79 32.92,5.79 U1.2
N$32
  Bottom 0.152: U$1.P$15 9.3,64.47 9.6,64.47 10.67,63.4 C34.1
N$36
  Bottom 0.152: U$1.P$12 9.3,65.99 10.06,65.99 11.28,67.21 R16.1
N$37
  Bottom 0.152: U$1.P$13 9.3,65.53 10.82,65.53 11.12,65.84 C35.1
N$38
  Bottom 0.152: U$1.P$14 9.3,64.92 10.82,64.92 11.12,64.62 C36.1
N$39
  Bottom 0.152: U$1.P$27 4.12,64.92 3.66,64.92 2.9,64.16 2.59,64.16 C37.1
N$40
  Top 0.152: LED1.C 3.81,3.5 3.81,4.57 R4.1
N$41
  Top 0.152: R7.1 11.43,4.27 10.06,4.27 9.75,4.57 U$70.5
N$50
  Bottom 0.152: 37.95,58.67 37.95,59.59 R29.1 | 37.95,58.67 37.95,58.37 C39.1 37.95,58.67 | 37.95,58.67 R25.1 39.17,60.05 39.17,61.11 37.64,62.64 37.19,62.64 U$12.13
N$51
  Bottom 0.152: R27.1 39.17,65.08 39.17,64.16 R26.1 39.01,64.01 37.19,64.01 U$12.12
N$56
  Bottom 0.152: R40.2 28.35,71.32 28.35,70.26 C40.1 28.35,70.1 29.26,69.19 29.26,68.89 R38.1 29.41,68.73 29.87,68.73 30.79,67.82 31.39,67.82 U$12.6
N$60
  Bottom 0.152: 29.87,66.6 29.87,67.51 R39.1 | 29.87,66.6 31.39,66.6 U$12.5 | 29.87,66.6 R41.1
PUSH_BUTTON  (via drill 0.41)
  Top 0.152: v12.95,18.9 17.07,18.9 20.42,15.54 U$11.NO
  Bottom 0.152: R31.1 20.27,13.11 20.27,15.24 20.42,15.39 U$11.NO | v12.95,18.9 12.65,19.2 12.65,20.12 IC2.88
R/W  (via drill 0.41)
  Top 0.152: v29.11,41.91 25.91,41.91 22.1,38.1 v21.18,38.1
  Bottom 0.152: v29.11,41.91 30.48,43.28 30.48,45.57 28.8,47.24 28.8,47.4 28.5,47.7 28.04,47.7 U$5.16 | v21.18,38.1 21.18,36.42 19.2,34.44 19.2,33.53 18.59,32.92 18.14,32.92 16.61,34.44 16.61,35.66 IC2.46
RES  (via drill 0.41)
  Top 0.152: v29.11,45.11 27.28,45.11 19.81,37.64 19.81,36.73 18.14,35.05 17.22,35.05 v16.15,33.98
  Bottom 0.152: v29.11,45.11 28.04,45.11 U$5.21 | v16.15,33.98 15.09,35.05 15.09,35.66 IC2.43
RESET
  Bottom 0.152: TP2.TP 12.34,7.47 11.58,7.47 IC1.28
ROTA  (via drill 0.41)
  Top 0.152: v12.19,21.49 17.53,21.49 23.62,15.39 27.13,15.39 28.65,13.87 29.72,13.87 U$11.A
  Bottom 0.152: R17.1 29.26,16.31 29.26,14.33 29.72,13.87 U$11.A | v12.19,21.49 12.19,20.27 IC2.89
ROTB  (via drill 0.41)
  Top 0.152: v11.58,18.44 11.58,15.24 20.42,6.4 20.42,4.72 U$11.B
  Bottom 0.152: R18.1 20.42,7.62 20.42,4.72 U$11.B | v11.58,18.44 11.58,20.12 IC2.90
RXD0  (via drill 0.41)
  Top 0.152: v13.11,8.53 13.11,8.99 7.16,14.94 v7.16,19.05
  Bottom 0.152: v13.11,8.53 11.58,8.53 IC1.26 | v7.16,19.05 7.16,20.12 IC2.99
SCK  (via drill 0.41)
  Top 0.152: v18.44,27.58 22.4,27.58 v24.69,25.3
  Bottom 0.152: v18.44,27.58 19.36,28.5 20.27,28.5 IC2.62 | v24.69,25.3 23.47,25.3 U$64.5
SCL  (via drill 0.41)
  Top 0.152: v14.33,77.11 17.83,73.61 17.83,71.93 U2.1 17.83,71.78 17.83,69.04 15.85,67.06 15.85,53.65 v16.15,53.34 | U1.8 35.36,6.86 37.19,6.86 R13.1 37.34,6.86 37.8,6.4 37.8,4.88 37.95,4.72 38.86,4.72 39.17,5.03 39.17,10.06 34.14,15.09 27.89,15.09 19.96,23.01 v15.85,23.01 | v7.32,44.5 7.32,36.73 v5.79,35.2
  Bottom 0.152: U$1.P$10 9.3,67.06 9.75,67.06 10.36,67.67 10.36,68.28 13.87,71.78 17.83,71.78 U2.1 | v14.33,77.11 12.04,77.11 R12.1 | R11.1 3.05,33.53 4.72,33.53 IC2.24 4.88,33.38 5.79,33.38 | 5.79,33.38 7.16,33.38 14.02,26.52 14.02,24.84 v15.85,23.01 | v7.32,44.5 v16.15,53.34 | 5.79,33.38 v5.79,35.2
SDA  (via drill 0.41)
  Top 0.152: U1.7 35.36,5.64 35.51,5.49 37.03,5.49 R14.1 37.19,5.33 v37.19,4.42 | v4.88,34.75 4.88,32.77 7.47,30.18 8.84,30.18 10.82,32.16 v11.12,32.16 15.54,36.58 15.54,46.48 15.39,46.63 15.39,74.22 U2.2
  Bottom 0.152: U$1.P$9 9.3,67.51 10.06,68.28 10.06,68.43 15.24,73.61 15.24,74.22 U2.2 15.39,74.37 17.07,74.37 19.96,77.27 23.01,77.27 R20.1 | 4.42,34.29 4.72,33.98 IC2.25 | 4.42,34.29 3.81,34.9 R10.1 | v37.19,4.42 20.12,21.49 19.66,21.49 15.39,25.76 15.39,28.96 12.19,32.16 v11.12,32.16 | 4.42,34.29 v4.88,34.75
SVDD
  Bottom 0.152: C53.1 0.91,61.27 1.83,61.27 C52.1 1.98,61.27 2.9,61.27 C51.1 3.05,61.27 3.96,61.27 C50.1 4.12,61.27 4.88,62.03 4.88,63.09 U$1.P$24 5.03,63.25 5.03,63.7 5.18,63.86 6.25,63.86 6.4,63.7 6.4,63.25 U$1.P$21
TGT_NRESET  (via drill 0.41)
  Top 0.152: R30.1 1.07,26.98 2.44,26.98 C29.2 2.59,27.13 2.9,27.13 4.12,28.35 U$16.1 4.12,28.5 3.5,29.11 v3.5,30.02
  Bottom 0.152: v3.5,30.02 4.72,30.02 IC2.17
TGT_SBL_ISP  (via drill 0.41)
  Top 0.152: v21.64,32.31 12.8,23.47 8.23,23.47 4.42,19.66 4.42,18.59 U$18.2
  Bottom 0.152: TP1.TP 22.1,37.64 22.1,36.88 19.51,34.29 19.51,33.22 19.66,33.07 20.27,33.07 IC2.53 20.42,32.92 21.03,32.92 v21.64,32.31
TXD0  (via drill 0.41)
  Top 0.152: v13.56,9.45 13.56,9.75 7.92,15.39 7.92,21.18 v7.62,21.49
  Bottom 0.152: v13.56,9.45 13.11,9.45 12.8,9.14 11.58,9.14 IC1.25 | v7.62,21.49 7.62,20.27 IC2.98
USB_BUS  (via drill 0.41)
  Top 0.152: 9.6,2.29 9.6,2.74 U$70.4 | 9.6,2.29 9.6,1.22 C8.1 | 12.5,3.5 12.5,2.74 12.04,2.29 9.6,2.29 | 12.5,3.5 v12.5,4.27 | 3.05,2.74 3.66,2.13 LED1.A | 12.5,3.5 10.67,3.5 10.21,3.96 8.99,3.96 7.62,5.33 3.35,5.33 3.05,5.03 3.05,2.74 | 3.05,2.74 v2.9,2.74
  Bottom 0.152: v12.5,4.27 10.82,4.27 U$69.1 | 7.62,6.86 7.01,7.47 IC1.8 | v2.9,2.74 4.57,4.42 4.57,6.55 4.88,6.86 7.62,6.86 | 7.62,6.86 IC1.7
VBATT  (via drill 0.41)
  Top 0.152: U$70.3 7.01,2.74 5.79,1.52 5.18,1.52 C5.1 5.03,1.37 4.42,1.37 4.27,1.22 3.35,1.22 2.13,2.44 2.13,4.57 3.96,6.4 v16.92,6.4
  Bottom 0.152: U$7.1 25.6,6.25 26.36,7.01 26.36,7.77 27.43,8.84 28.8,8.84 28.96,8.69 28.96,7.92 28.65,7.62 28.04,7.62 27.13,6.71 27.13,6.1 27.43,5.79 28.19,5.79 29.72,4.27 29.72,3.35 28.5,2.13 26.82,2.13 26.67,2.29 26.67,2.44 26.21,2.9 C4.1 26.06,3.05 20.27,3.05 v16.92,6.4
VBREF
  Bottom 0.152: C6.1 24.99,40.23 27.43,42.67 27.89,42.67 U$5.26
VCC  (via drill 0.41)
  Top 0.152: U$8.4 31.09,72.69 v31.85,72.69 32.16,72.69 37.49,78.03 37.49,78.49 36.88,79.1 28.5,79.1 27.74,78.33 U$6.8 | C33.1 34.59,1.68 33.07,3.2 U1.4 33.07,3.35 33.83,4.12 33.83,7.77 | R14.2 38.56,5.49 R13.2 38.56,7.01 38.56,8.08 | 38.56,8.08 38.56,8.69 C30.1 | 34.14,8.08 35.36,9.3 C31.A | 34.14,8.08 33.83,7.77 | 33.83,7.77 33.22,7.16 | 33.22,7.16 33.07,7.01 U1.1 33.22,7.16 | 34.14,8.08 38.56,8.08 | 33.22,7.16 v31.7,7.16 | v2.44,23.32 1.07,24.69 1.07,25.45 R30.2 | 5.64,28.04 v6.1,28.04 | 5.64,28.04 4.12,26.52 3.2,26.52 3.05,26.36 1.83,26.36 1.07,25.6 R30.2 | 5.64,29.87 5.64,30.33 v1.37,34.59 | 5.64,29.87 5.64,28.04 | v25.91,51.21 28.35,53.65 v29.11,53.65 29.87,53.65 31.39,55.17 | v33.22,57 31.39,55.17 | 5.64,29.87 9.75,29.87 v14.33,34.44 | v1.37,14.33 1.37,16.15 0.91,16.61 0.91,25.45 R30.2 | 31.39,55.17 v25.6,60.96
  Bottom 0.152: C18.1 21.49,68.12 21.49,66.45 21.79,66.14 U$14.4 21.95,65.99 21.95,64.31 U$14.5 21.95,64.16 24.69,61.42 24.84,61.42 | 24.84,61.42 23.47,60.05 U$15.1 | 24.84,61.42 24.99,61.57 | 24.99,61.57 26.52,63.09 R42.2 26.67,63.09 27.13,62.64 27.89,62.64 R43.1 28.04,62.64 28.96,63.55 28.96,64.62 29.57,65.23 31.39,65.23 U$12.4 31.55,65.38 32,65.38 33.83,67.21 33.83,69.19 31.85,71.17 v31.85,72.69 | 20.27,10.82 20.27,11.28 R31.2 | 20.27,10.82 20.27,9.45 R18.2 | 20.27,10.82 26.67,10.82 27.28,10.21 C2.1 27.43,10.06 28.04,10.06 29.26,8.84 29.26,7.77 | 29.26,7.77 28.19,6.71 28.19,6.4 U$7.5 | 29.26,7.77 31.09,7.77 v31.7,7.16 33.07,7.16 36.88,3.35 37.49,3.35 39.32,5.18 39.32,12.19 37.95,13.56 C24.1 37.8,13.72 37.19,14.33 37.19,15.85 C10.2 37.03,16 35.05,17.98 29.26,17.98 R17.2 29.11,18.14 29.11,21.79 24.23,26.67 | R19.2 3.5,11.43 3.5,6.86 3.66,6.71 R2.2 | 10.82,17.68 12.65,17.68 14.63,19.66 14.63,20.12 IC2.84 | 10.82,17.68 9.6,17.68 8.53,18.75 8.53,20.12 IC2.96 | 10.82,17.68 4.72,11.58 3.5,11.58 R19.2 | v2.44,23.32 2.44,24.38 C13.1 2.44,24.54 2.44,25.76 L2.P$1 | v6.1,28.04 4.88,28.04 IC2.13 | 1.68,34.29 1.68,33.53 R11.2 | 1.68,34.29 2.29,34.9 R10.2 2.44,35.05 4.27,36.88 OSC3.P$1 4.42,37.03 4.42,38.56 OSC3.P$4 4.42,38.71 5.94,40.23 | 7.47,38.71 7.47,39.01 C28.2 | 7.47,38.71 7.47,37.64 C12.1 | 7.47,38.71 5.94,40.23 | 5.94,40.23 4.12,42.06 R1.2 | 7.47,38.71 C28.2 | IC2.28 7.62,35.81 7.62,39.01 C28.2 | 1.68,34.29 v1.37,34.59 | U$5.27 28.04,42.22 28.5,42.22 30.18,43.89 30.18,45.41 28.96,46.63 28.04,46.63 U$5.18 | 25.15,51.21 26.06,50.29 26.06,48.46 27.89,46.63 U$5.18 | 25.15,51.21 24.69,51.66 C27.1
  Bottom 0.152: U$5.17 28.04,47.09 28.04,46.79 U$5.18 | v29.11,53.65 28.04,53.65 U$5.4 | 25.15,51.21 v25.91,51.21 | C14.1 14.48,38.25 14.48,36.58 14.63,36.42 14.63,35.81 IC2.42 14.63,35.66 14.63,34.75 | 16.76,32.46 20.27,32.46 IC2.54 | 16.76,32.46 14.63,34.59 14.63,34.75 | 35.36,57 35.36,37.8 24.23,26.67 | 35.36,57 35.36,58.37 C11.1 | 24.23,26.67 24.08,26.52 23.47,26.52 U$64.4 23.32,26.36 22.86,26.36 22.25,25.76 22.25,25.15 21.18,24.08 20.42,24.08 IC2.71 20.27,23.93 19.66,23.93 19.51,23.77 17.83,23.77 16,25.6 16,31.7 16.76,32.46 | 35.36,57 v33.22,57 | 14.63,34.75 v14.33,34.44 | v1.37,14.33 2.29,13.41 2.29,12.65 3.35,11.58 R19.2 | v25.6,60.96 24.99,61.57
VCC_HALF  (via drill 0.41)
  Top 0.152: v28.65,65.23 31.09,65.23 v33.22,63.09
  Bottom 0.152: 28.35,65.23 28.35,66.45 R41.2 | 28.35,65.23 28.35,64.16 R21.1 | 27.89,60.66 27.89,61.27 R43.2 | 27.89,60.66 27.89,60.05 R44.1 | 27.89,60.66 29.57,60.66 29.72,60.5 29.72,59.44 30.02,59.13 33.22,59.13 33.38,59.28 33.38,60.35 33.22,60.5 v33.22,63.09 35.97,65.84 38.1,65.84 38.56,66.29 39.17,66.29 R27.2 | v28.65,65.23 28.35,65.23
VCC_LED  (via drill 0.41)
  Top 0.152: v25.91,34.59 25.91,33.38 26.52,32.77 v29.41,32.77 | v26.82,54.71 v25.91,55.63 24.08,53.8 22.25,53.8 16.61,59.44 v16.61,62.79
  Bottom 0.152: R3.2 14.17,66.6 14.17,64.62 14.02,64.47 C19.1 14.02,64.31 15.09,63.25 15.09,62.79 | 15.09,62.79 15.09,62.33 D2.2 15.09,62.79 | C26.1 24.69,50.29 23.77,51.21 23.77,53.65 24.54,54.41 24.54,54.71 C20.1 24.69,54.86 25.76,55.93 25.91,55.93 | v25.91,34.59 25.91,38.25 26.06,38.41 26.06,39.93 27.28,41.15 27.89,41.15 U$5.29 | v29.41,32.77 29.41,33.22 35.05,38.86 35.05,52.73 32,55.78 29.41,55.78 29.26,55.93 25.91,55.93 | v26.82,54.71 27.89,54.71 U$5.2 | 25.91,55.93 v25.91,55.63 | v16.61,62.79 15.09,62.79
VCOMH  (via drill 0.41)
  Top 0.152: v29.11,54.71 28.35,53.95 28.19,53.95 26.21,51.97 24.08,51.97 v21.95,49.84
  Bottom 0.152: C22.1 24.69,44.2 24.08,44.81 23.93,44.81 23.77,44.96 23.77,47.7 24.69,48.62 C25.1 24.69,48.77 24.08,49.38 22.4,49.38 v21.95,49.84 | v29.11,54.71 28.65,54.25 28.04,54.25 U$5.3
VDD
  Bottom 0.152: 8.23,6.86 IC1.6 8.23,6.71 8.23,6.4 8.08,6.25 5.49,6.25 R5.2
VPA
  Bottom 0.152: C7.1 24.99,41.6 25.76,41.6 27.28,43.13 27.89,43.13 U$5.25
VPB
  Bottom 0.152: C21.1 24.84,42.98 26.67,42.98 27.28,43.59 27.89,43.59 U$5.24
VPC
  Bottom 0.152: C1.1 24.69,45.41 25.76,45.41 26.98,44.2 27.89,44.2 U$5.23
VSL  (via drill 0.41)
  Top 0.152: v25.6,54.1 26.21,54.1 v26.82,53.49
  Bottom 0.152: v25.6,54.1 24.69,53.19 R9.2 | v26.82,53.49 27.13,53.49 27.43,53.19 27.89,53.19 U$5.5
VSR  (via drill 0.41)
  Top 0.152: v37.03,74.68 34.75,74.68 26.06,65.99 v25.91,65.99
  Bottom 0.152: R42.1 26.67,64.62 26.67,65.53 26.98,65.84 C41.1 26.98,65.99 v25.91,65.99 | v37.03,74.68 37.03,75.89 U$13.1

## Text on the board
tPlace: Infrared Temperature | EMF Detector | Microphone
_tsilk: U$12 | U$13 | C15 | C16 | U$18 | C14 | U$1 | C23 | C3 | U$7 | C2 | C9 | JP1 | C5 | R4 | C4 | U$4 | U$14 | C19 | C18 | R5 | D2 | C13 | C24 | C34 | U$5 | R3 | R6 | C21 | C6 | U$15 | C27 | C26 | C25 | C1 | C22 | C7 | C20 | D1 | R9 | R8 | LED1 | R7 | R11 | R12 | R13
_bsilk: U$2 | R17 | C31 | R18 | C30 | C29 | U$17 | C17 | R15 | C28 | R16 | R14 | U$16 | C12 | U$8 | R2 | C10 | C11 | U$6 | J2 | U$3 | R19 | U$10 | R1 | U$9